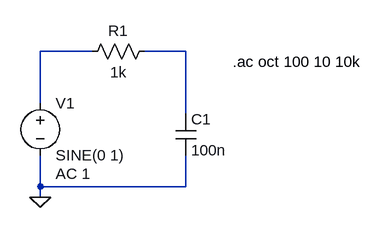
[diagram p0: schematic lab4_RC-filter.asc]
lab4_RC-filter.asc, the LTspice schematic file:
Version 4
SHEET 1 880 680
WIRE 96 64 16 64
WIRE 240 64 176 64
WIRE 16 144 16 64
WIRE 240 160 240 64
WIRE 16 272 16 224
WIRE 240 272 240 224
WIRE 240 272 16 272
WIRE 16 288 16 272
FLAG 16 288 0
SYMBOL voltage 16 128 R0
WINDOW 123 24 124 Left 2
WINDOW 39 0 0 Left 2
SYMATTR InstName V1
SYMATTR Value SINE(0 1)
SYMATTR Value2 AC 1
SYMBOL res 192 48 R90
WINDOW 0 0 56 VBottom 2
WINDOW 3 32 56 VTop 2
SYMATTR InstName R1
SYMATTR Value 1k
SYMBOL cap 224 160 R0
SYMATTR InstName C1
SYMATTR Value 100n
TEXT 312 80 Left 2 !.ac oct 100 10 10k

The netlist it stands for:
* lab4_RC-filter.asc
V1 N001 0 SINE(0 1) AC 1
R1 N002 N001 1k
C1 N002 0 100n
.ac oct 100 10 10k
.backanno
.end